# Altium schematic sheet J_TAG_SCH.SchDoc
size A3
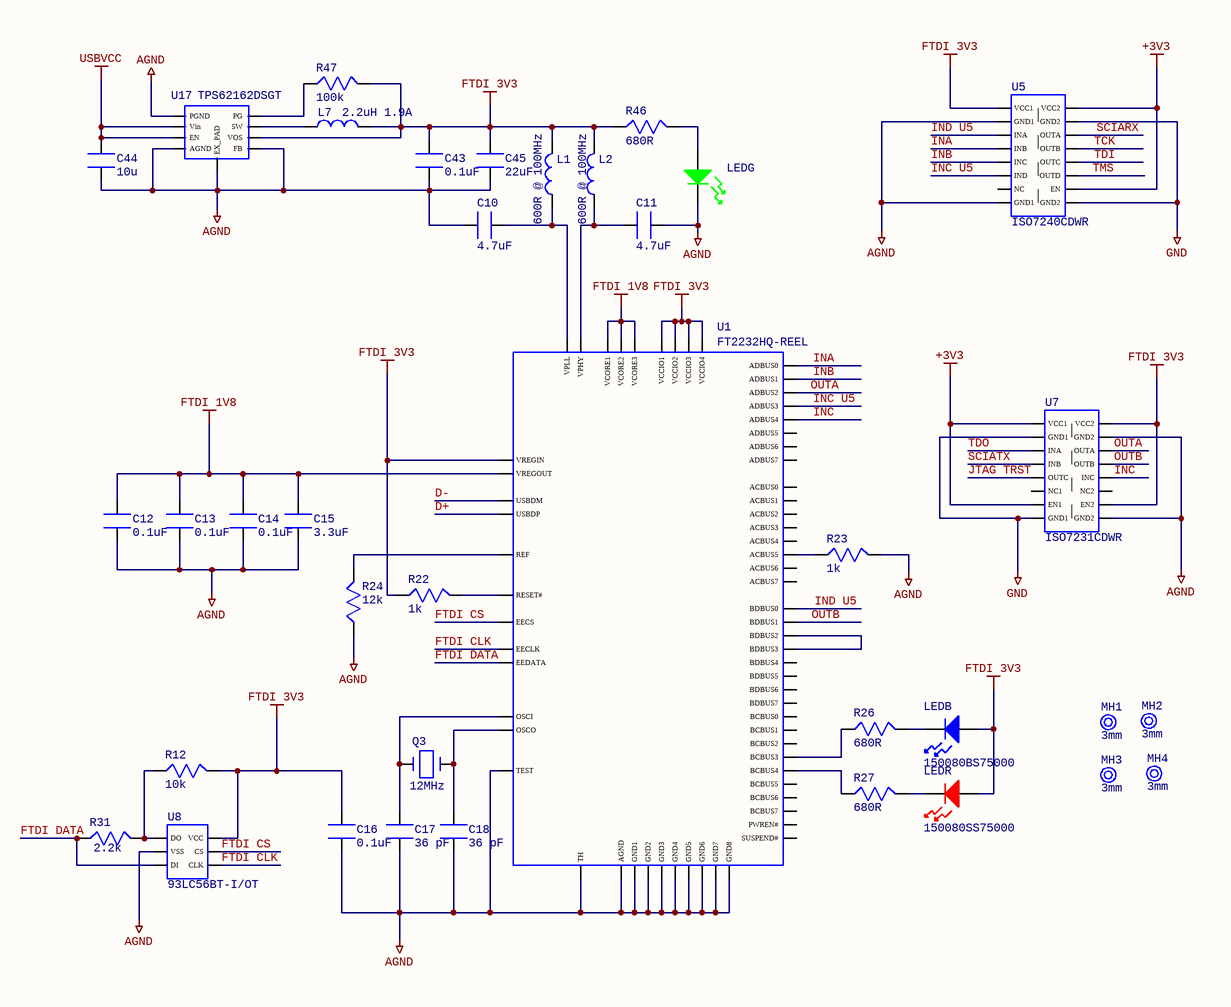
[diagram p0: J_TAG_SCH.SchDoc]

## Parts
C10  4.7uF  [GRM155R60J475ME47D]
C11  4.7uF  [GRM155R60J475ME47D]
C12  0.1uF  [GRM155R61A104KA01D]
C13  0.1uF  [GRM155R61A104KA01D]
C14  0.1uF  [GRM155R61A104KA01D]
C15  3.3uF  [C1608X5R1C335K080AC]
C16  0.1uF  [GRM155R61A104KA01D]
C17  36 pF  [GRM1555C1H360JA01D]
C18  36 pF  [GRM1555C1H360JA01D]
C43  0.1uF  [GRM155R61A104KA01D]
C44  10u  [GRM32DR71E106KA12L]
C45  22uF  [GRM32ER61E226KE15L]
L1  600R @ 100MHz  [BLM15AG601SN1D]
L2  600R @ 100MHz  [BLM15AG601SN1D]
L7  2.2uH 1.9A  [CDRH2D18/HPNP-2R2NC]
LEDB  150080BS75000  [150080BS75000]
LEDG  (no value)  [150080VS75000]
LEDR  150080SS75000  [150080SS75000]
MH1  3mm  [MH_3MM]
MH2  3mm  [MH_3MM]
MH3  3mm  [MH_3MM]
MH4  3mm  [MH_3MM]
Q3  12MHz  [ABLS2-12.000MHZ-D4Y-T]
R12  10k  [RC0402FR-0710KL]
R22  1k  [RC0402FR-071KL]
R23  1k  [RC0402FR-071KL]
R24  12k  [RC0402FR-0712KL]
R26  680R  [RC0402FR-07680RL]
R27  680R  [RC0402FR-07680RL]
R31  2.2k  [CRCW04022K20FKEDC]
R46  680R  [RC0402FR-07680RL]
R47  100k  [RC0402FR-07100KL]
U1  FT2232HQ-REEL  [FT2232HQ-REEL]
U5  ISO7240CDWR  [ISO7240CDWR]
U7  ISO7231CDWR  [ISO7231CDWR]
U8  93LC56BT-I/OT  [93LC56BT-I/OT]
U17  TPS62162DSGT  [TPS62162DSGT]

## Nets
+3V3: U5.EN U5.VCC2 U7.EN1 U7.VCC1
AGND: C10.1 C11.2 C12.1 C13.1 C14.1 C15.1 C16.1 C17.1 C18.1 C43.1 C44.1 C45.1 LEDG.K R23.2 R24.1 U1.AGND U1.GND1 U1.GND2 U1.GND3 U1.GND4 U1.GND5 U1.GND6 U1.GND7 U1.GND8 U1.TEST U1.TH U5.GND1 U7.GND2 U8.VSS U17.AGND U17.EX_PAD U17.FB U17.PGND
FTDI 1V8: C12.2 C13.2 C14.2 C15.2 U1.VCORE1 U1.VCORE2 U1.VCORE3 U1.VREGOUT
FTDI 3V3: C16.2 C43.2 C45.2 L1.1 L2.1 L7.1 LEDB.A LEDR.A R12.2 R22.1 R46.1 R47.2 U1.VCCIO1 U1.VCCIO2 U1.VCCIO3 U1.VCCIO4 U1.VREGIN U5.VCC1 U7.EN2 U7.VCC2 U8.VCC U17.VOS
GND: U5.GND2 U7.GND1
USBVCC: C44.2 U17.EN U17.Vin
D+: U1.USBDP
D-: U1.USBDM
FTDI CLK: U1.EECLK U8.CLK
FTDI CS: U1.EECS U8.CS
FTDI DATA: R31.1 U1.EEDATA U8.DI
INA: U1.ADBUS0 U5.INB
INB: U1.ADBUS1 U5.INC
INC: U1.ADBUS4 U7.INC
INC U5: U1.ADBUS3 U5.IND
IND U5: U1.BDBUS0 U5.INA
JTAG TRST: U7.OUTC
OUTA: U1.ADBUS2 U7.OUTA
OUTB: U1.BDBUS1 U7.OUTB
SCIARX: U5.OUTA
SCIATX: U7.INB
TCK: U5.OUTB
TDI: U5.OUTC
TDO: U7.INA
TMS: U5.OUTD
NetC10_2: C10.2 L1.2 U1.VPLL
NetC11_1: C11.1 L2.2 U1.VPHY
NetC17_2: C17.2 Q3.1 U1.OSCI
NetC18_2: C18.2 Q3.2 U1.OSCO
NetL7_2: L7.2 U17.SW
NetLEDB_K: LEDB.K R26.2
NetLEDG_A: LEDG.A R46.2
NetLEDR_K: LEDR.K R27.2
NetR12_1: R12.1 R31.2 U8.DO
NetR22_2: R22.2 U1.RESET#
NetR23_1: R23.1 U1.ACBUS5
NetR24_2: R24.2 U1.REF
NetR26_1: R26.1 U1.BCBUS3
NetR27_1: R27.1 U1.BCBUS4
NetR47_1: R47.1 U17.PG
NetU1_BDBUS2: U1.BDBUS2 U1.BDBUS3

Not connected (* = marked no-connect by the designer): U1 ACBUS0 ACBUS1 ACBUS2 ACBUS3 ACBUS4 ACBUS6 ACBUS7 ADBUS5 ADBUS6 ADBUS7 BCBUS0 BCBUS1 BCBUS2 BCBUS5 BCBUS6 BCBUS7 BDBUS4 BDBUS5 BDBUS6 BDBUS7 PWREN# SUSPEND#; U5 NC; U7 NC1 NC2

## Library data of the parts
C10 C11 = GRM155R60J475ME47D: C10, C11; Supplier 1: Digi-Key; Supplier Part Number 1: 490-5915-1-ND
C12-C14 C16 C43 = GRM155R61A104KA01D: C12, C13, C14, C16, C43; Supplier 1: Digi-Key; Supplier Part Number 1: 490-1318-6-ND
C15 = C1608X5R1C335K080AC: C15; Supplier 1: Digi-Key; Supplier Part Number 1: 445-7476-6-ND
C17 C18 = GRM1555C1H360JA01D: C17, C18; Supplier 1: Digi-Key; Supplier Part Number 1: 490-6044-6-ND
C44 = GRM32DR71E106KA12L: C41, C44, 10u; Supplier 1: Digi-Key; Supplier Part Number 1: 490-1867-6-ND
C45 = GRM32ER61E226KE15L: C45; Supplier 1: Digi-Key; Supplier Part Number 1: 490-3889-6-ND
L1 L2 = BLM15AG601SN1D: L1, L2; Supplier 1: Digi-Key; Supplier Part Number 1: 490-1006-6-ND
L7 = CDRH2D18/HPNP-2R2NC: L7; Supplier 1: Digi-Key; Supplier Part Number 1: 308-2295-6-ND
LEDB = 150080BS75000onent_1: BLUE LED; Supplier 1: Digi-Key; Supplier Part Number 1: 732-4982-6-ND
LEDG = 150080VS75000: GREEN LED; Supplier 1: Digi-Key; Supplier Part Number 1: 732-4986-6-ND
LEDR = 150080SS75000: RED LED; Supplier 1: Digi-Key; Supplier Part Number 1: 732-4985-6-ND
MH1-MH4 = TH_3MM: odsojnik
Q3 = ABLS2-12.000MHZ-D4Y-T: Oscilator 12MHz; Supplier 1: Digi-Key; Supplier Part Number 1: 535-9869-6-ND
R12 = RC0402FR-0710KL: R12, 10K; Supplier 1: Digi-Key; Supplier Part Number 1: 311-10.0KLRDKR-ND
R22 R23 = RC0402FR-071KL: R22, R23, 1K; Supplier 1: Digi-Key; Supplier Part Number 1: 311-1.00KLRDKR-ND
R24 = RC0402FR-0712KL: Supplier 1: Digi-Key; Supplier Part Number 1: 311-12.0KLRDKR-ND
R26 R27 R46 = RC0402FR-07680RL: R26, R27, R46, RC0402FR-07680RL; Supplier 1: Digi-Key; Supplier Part Number 1: 311-680LRDKR-ND
R31 = CRCW04022K20FKEDC: R31; Supplier 1: Digi-Key; Supplier Part Number 1: 541-3971-6-ND
R47 = RC0402FR-07100KL: Supplier 1: Digi-Key; Supplier Part Number 1: 311-100KLRDKR-ND
U1 = FT2232HQ-REEL: IC kontroler; Supplier 1: Digi-Key; Supplier Part Number 1: 768-1025-6-ND
U5 = ISO7240CDWR: Izolator; Supplier 1: Digi-Key; Supplier Part Number 1: 296-38555-6-ND
U7 = ISO7231CDWR: Izolator; Supplier 1: Digi-Key; Supplier Part Number 1: 296-38966-6-ND
U8 = 93LC56BT-I/OT: IC memorija; Supplier 1: Digi-Key; Supplier Part Number 1: 93LC56BT-I/OTDKR-ND
U17 = TPS62162DSGT: DC-DC Buck; Supplier 1: Digi-Key; Supplier Part Number 1: 296-29897-1-ND